# Altium schematic sheet 0_Overview.SchDoc: Overview
size A3; DocumentNumber: 1; SheetNumber: 1; SheetTotal: 6; PageSetup: Record=PageOptions|CenterHorizontal=True|CenterVertical=True|PrintScale=1.01|XCorrection=1.00|YCorrection=1.00|PrintKind=0|BorderSize=5000000|LeftOffset=0|BottomOffset=0|Orientation=2|PaperLength=1000|PaperWidth=1000|Scale=100|PaperSource=7|PrintQuality=-4|MediaType=1|DitherType=10|PaperKind=A3|PrintScaleMode=1
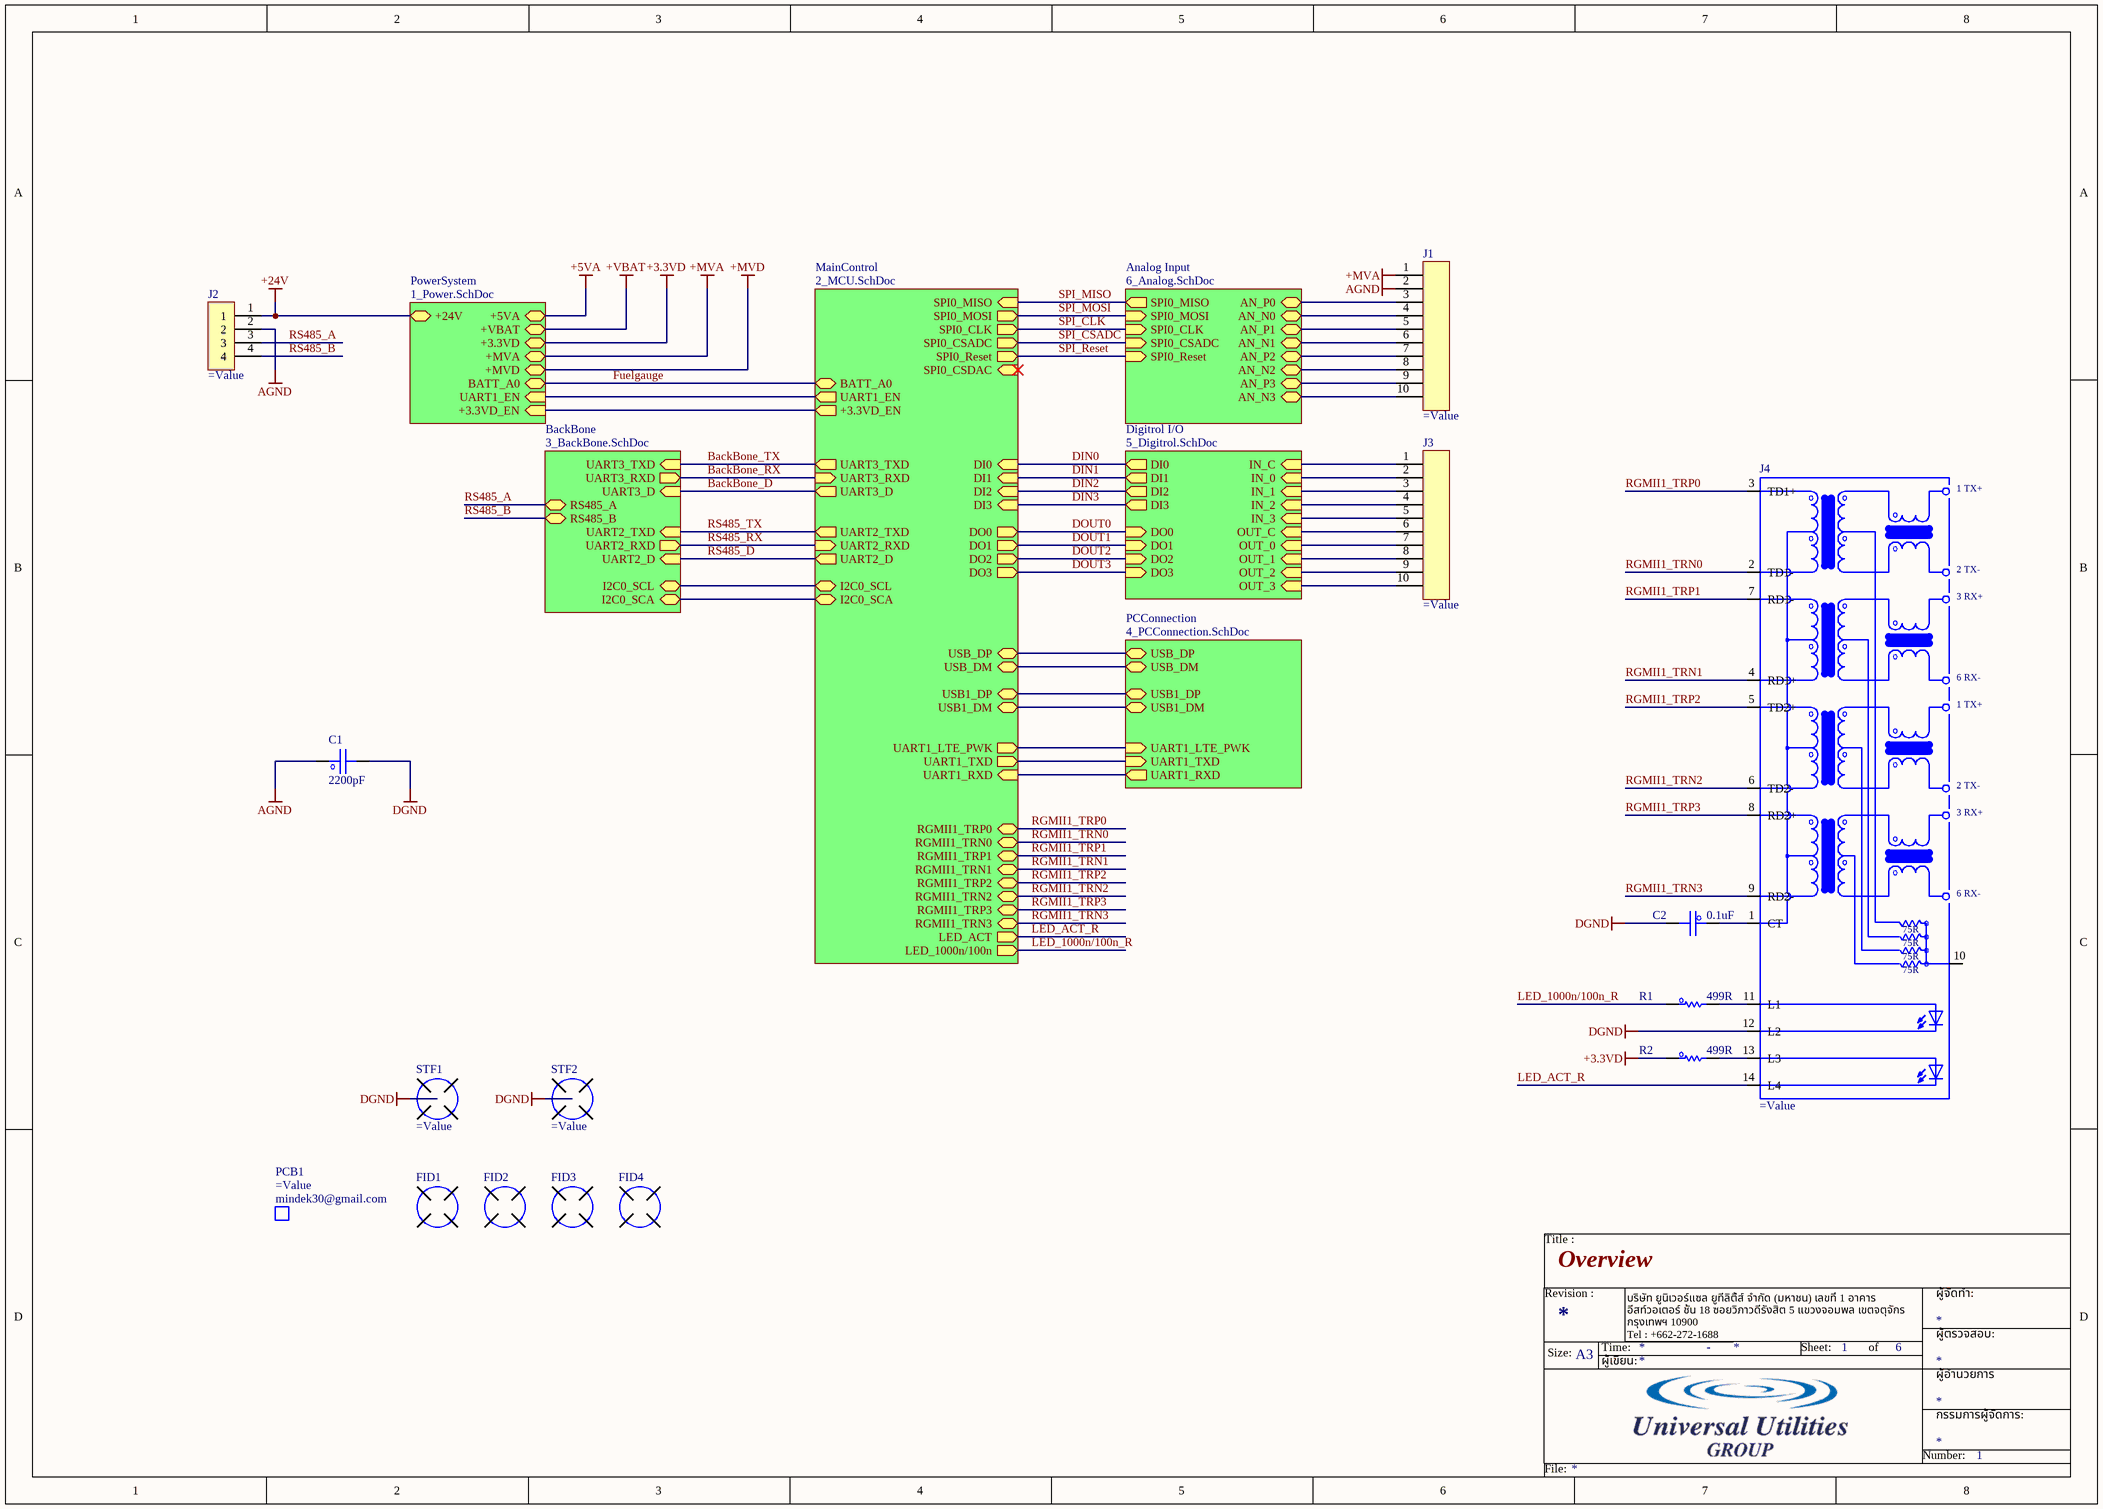
[diagram p0: 0_Overview.SchDoc]

## Parts
C1  2200pF  [C_1206]
C2  0.1uF  [C_0603]
FID1  FIDUCIAL  [FID]  (value not drawn)  (no BOM)
FID2  FIDUCIAL  [FID]  (value not drawn)  (no BOM)
FID3  FIDUCIAL  [FID]  (value not drawn)  (no BOM)
FID4  FIDUCIAL  [FID]  (value not drawn)  (no BOM)
J1  (no value)  [CON_10P_Terminal]
J2  (no value)  [CON_4P_Terminal]
J3  (no value)  [CON_10P_Terminal]
J4  (no value)  [HY911103A_HAN]
PCB1  Manufacturer: mindek30@gmail.com  (mechanical)
R1  499R  [R_0603]
R2  499R  [R_0603]
STF1  (no value)  [StandOff]
STF2  (no value)  [StandOff]

## Sub-sheets
Analog Input = 6_Analog.SchDoc: SPI0_MISO (out), SPI0_MOSI (in), SPI0_CLK (in), SPI0_CSADC (in), SPI0_Reset (in), AN_P0 (bidir), AN_P1 (bidir), AN_P2 (bidir), AN_P3 (bidir), AN_N0 (bidir), AN_N1 (bidir), AN_N2 (bidir), AN_N3 (bidir)
BackBone = 3_BackBone.SchDoc: UART2_D (in), UART3_TXD (in), UART3_RXD (out), UART3_D (in), UART2_TXD (in), UART2_RXD (out), RS485_A (bidir), RS485_B (bidir), I2C0_SCL (bidir), I2C0_SCA (bidir)
Digitrol I/O = 5_Digitrol.SchDoc: DI0 (out), DI1 (out), DI2 (out), DI3 (out), DO0 (in), DO1 (in), DO2 (in), DO3 (in), IN_0 (in), IN_1 (in), IN_2 (in), IN_3 (in), OUT_0 (in), OUT_1 (in), OUT_2 (in), OUT_3 (in), OUT_C (in), IN_C (in)
MainControl = 2_MCU.SchDoc: SPI0_MISO (in), SPI0_MOSI (out), SPI0_CLK (out), DI0 (in), DI1 (in), DI2 (in), DI3 (in), DO0 (out), DO1 (out), DO2 (out), DO3 (out), SPI0_Reset (out), UART3_TXD (out), UART3_RXD (in), UART3_D (out), BATT_A0 (bidir), SPI0_CSADC (out), UART2_TXD (out), UART2_RXD (in), UART2_D (out), USB_DP (bidir), USB_DM (bidir), UART1_RXD (in), UART1_EN (out), UART1_TXD (out), I2C0_SCL (bidir), I2C0_SCA (bidir), USB1_DP (bidir), USB1_DM (bidir), RGMII1_TRN0 (bidir), RGMII1_TRP3 (bidir), RGMII1_TRP0 (bidir), RGMII1_TRP2 (bidir), RGMII1_TRP1 (bidir), RGMII1_TRN2 (bidir), RGMII1_TRN3 (bidir), RGMII1_TRN1 (bidir), LED_ACT (out), LED_1000n/100n (out), SPI0_CSDAC (in), +3.3VD_EN (out), UART1_LTE_PWK (out)
PCConnection = 4_PCConnection.SchDoc: UART1_TXD (in), UART1_RXD (out), USB1_DP (bidir), USB1_DM (bidir), USB_DM (bidir), USB_DP (bidir), UART1_LTE_PWK (in)
PowerSystem = 1_Power.SchDoc: +5VA (bidir), +24V (bidir), +3.3VD (bidir), +MVA (bidir), +MVD (bidir), BATT_A0 (bidir), +VBAT (bidir), UART1_EN (in), +3.3VD_EN (in)

## Nets
+3.3VD: R2.1 ; sheet PowerSystem/+3.3VD
+5VA: sheet PowerSystem/+5VA
+24V: J2.1 ; sheet PowerSystem/+24V
+MVA: J1.1 ; sheet PowerSystem/+MVA
+MVD: sheet PowerSystem/+MVD
+VBAT: sheet PowerSystem/+VBAT
AGND: C1.1 J1.2 J2.2
DGND: C1.2 C2.2 J4.12(L2) STF1.1 STF2.1
BackBone_D: sheet MainControl/UART3_D, sheet BackBone/UART3_D
BackBone_RX: sheet MainControl/UART3_RXD, sheet BackBone/UART3_RXD
BackBone_TX: sheet MainControl/UART3_TXD, sheet BackBone/UART3_TXD
DIN0: sheet MainControl/DI0, sheet Digitrol I/O/DI0
DIN1: sheet MainControl/DI1, sheet Digitrol I/O/DI1
DIN2: sheet MainControl/DI2, sheet Digitrol I/O/DI2
DIN3: sheet MainControl/DI3, sheet Digitrol I/O/DI3
DOUT0: sheet MainControl/DO0, sheet Digitrol I/O/DO0
DOUT1: sheet MainControl/DO1, sheet Digitrol I/O/DO1
DOUT2: sheet MainControl/DO2, sheet Digitrol I/O/DO2
DOUT3: sheet MainControl/DO3, sheet Digitrol I/O/DO3
Fuelgauge: sheet MainControl/BATT_A0, sheet PowerSystem/BATT_A0
LED_1000n/100n_R: R1.1 ; sheet MainControl/LED_1000n/100n
LED_ACT_R: J4.14(L4) ; sheet MainControl/LED_ACT
RGMII1_TRN0: J4.2(TD1-) ; sheet MainControl/RGMII1_TRN0
RGMII1_TRN1: J4.4(RD1+) ; sheet MainControl/RGMII1_TRN1
RGMII1_TRN2: J4.6(TD2-) ; sheet MainControl/RGMII1_TRN2
RGMII1_TRN3: J4.9(RD2-) ; sheet MainControl/RGMII1_TRN3
RGMII1_TRP0: J4.3(TD1+) ; sheet MainControl/RGMII1_TRP0
RGMII1_TRP1: J4.7(RD1-) ; sheet MainControl/RGMII1_TRP1
RGMII1_TRP2: J4.5(TD2+) ; sheet MainControl/RGMII1_TRP2
RGMII1_TRP3: J4.8(RD2+) ; sheet MainControl/RGMII1_TRP3
RS485_A: J2.3 ; sheet BackBone/RS485_A
RS485_B: J2.4 ; sheet BackBone/RS485_B
RS485_D: sheet MainControl/UART2_D, sheet BackBone/UART2_D
RS485_RX: sheet MainControl/UART2_RXD, sheet BackBone/UART2_RXD
RS485_TX: sheet MainControl/UART2_TXD, sheet BackBone/UART2_TXD
SPI_CLK: sheet MainControl/SPI0_CLK, sheet Analog Input/SPI0_CLK
SPI_CSADC: sheet MainControl/SPI0_CSADC, sheet Analog Input/SPI0_CSADC
SPI_MISO: sheet MainControl/SPI0_MISO, sheet Analog Input/SPI0_MISO
SPI_MOSI: sheet MainControl/SPI0_MOSI, sheet Analog Input/SPI0_MOSI
SPI_Reset: sheet MainControl/SPI0_Reset, sheet Analog Input/SPI0_Reset
NetC2_1: C2.1 J4.1(CT)
NetJ1_3: J1.3 ; sheet Analog Input/AN_P0
NetJ1_4: J1.4 ; sheet Analog Input/AN_N0
NetJ1_5: J1.5 ; sheet Analog Input/AN_P1
NetJ1_6: J1.6 ; sheet Analog Input/AN_N1
NetJ1_7: J1.7 ; sheet Analog Input/AN_P2
NetJ1_8: J1.8 ; sheet Analog Input/AN_N2
NetJ1_9: J1.9 ; sheet Analog Input/AN_P3
NetJ1_10: J1.10 ; sheet Analog Input/AN_N3
NetJ3_1: J3.1 ; sheet Digitrol I/O/IN_C
NetJ3_2: J3.2 ; sheet Digitrol I/O/IN_0
NetJ3_3: J3.3 ; sheet Digitrol I/O/IN_1
NetJ3_4: J3.4 ; sheet Digitrol I/O/IN_2
NetJ3_5: J3.5 ; sheet Digitrol I/O/IN_3
NetJ3_6: J3.6 ; sheet Digitrol I/O/OUT_C
NetJ3_7: J3.7 ; sheet Digitrol I/O/OUT_0
NetJ3_8: J3.8 ; sheet Digitrol I/O/OUT_1
NetJ3_9: J3.9 ; sheet Digitrol I/O/OUT_2
NetJ3_10: J3.10 ; sheet Digitrol I/O/OUT_3
NetJ4_11: J4.11(L1) R1.2
NetJ4_13: J4.13(L3) R2.2
(unnamed): sheet MainControl/USB_DP, sheet PCConnection/USB_DP
(unnamed): sheet MainControl/USB_DM, sheet PCConnection/USB_DM
(unnamed): sheet MainControl/UART1_RXD, sheet PCConnection/UART1_RXD
(unnamed): sheet MainControl/UART1_EN, sheet PowerSystem/UART1_EN
(unnamed): sheet MainControl/UART1_TXD, sheet PCConnection/UART1_TXD
(unnamed): sheet MainControl/I2C0_SCL, sheet BackBone/I2C0_SCL
(unnamed): sheet MainControl/I2C0_SCA, sheet BackBone/I2C0_SCA
(unnamed): sheet MainControl/USB1_DP, sheet PCConnection/USB1_DP
(unnamed): sheet MainControl/USB1_DM, sheet PCConnection/USB1_DM
(unnamed): sheet MainControl/+3.3VD_EN, sheet PowerSystem/+3.3VD_EN
(unnamed): sheet MainControl/UART1_LTE_PWK, sheet PCConnection/UART1_LTE_PWK

Not connected (* = marked no-connect by the designer): J4 10(CT)

## Notes on the sheet
- Title :
- Revision :
- ผู้จัดทำ:
- Size:
- A3
- Time:
- ผู้เขียน:
- บริษัท ยูนิเวอร์แซล ยูทีลิตี้ส์ จำกัด (มหาชน) เลขที่ 1 อาคาร อีสท์วอเตอร์ ชั้น 18 ซอยวิภาวดีรังสิต 5 แขวงจอมพล เขตจตุจักร กรุงเทพฯ 10900
  Tel : +662-272-1688
  Fax :+662-2721690-1
- -
- Sheet:
- of
- ผู้อำนวยการ
- ผู้ตรวจสอบ:
- Number:
- กรรมการผู้จัดการ:
- File:
- (in symbol CON_RJ45_1) 1 TX+; 2 TX-; 3 RX+; 6 RX-; 75R

## Library data of the parts
C1 = C_Capacitor: CAP CER 2200PF 1KV X7R 1206; Manufacturer: AVX Corporation; PartNumber: 1206AC222KAT1A; PackageReference: 1206; PartID: 478-2953-1-ND; Value2: 1kV; Value: 2200pF; Value3: *
C2 = C_Capacitor: CAP CER 0.1UF 50V X7R 0603; Manufacturer: KEMET; PartNumber: C0603C104K5RACTU; PackageReference: 0603; PartID: 399-5089-1-ND; Value2: 50V; Value: 0.1uF; Value3: *
FID1-FID4 = FID_FIDUCIAL: Manufacturer: mindek30@gmail.com; Value2: Non SE; Value: Non SE; PartNumber: =PCB_PN+'_'+PCB_Rev; PartID: =PCB_Rev; PackageReference: Non SE; Value3: Non SE
J1 J3 = CON_10P_Terminal: TERM BLOCK HDR 10POS 90DEG 3.5MM; PartNumber: 1843871; Manufacturer: Phoenix Contact; Value: 1843871; Value3: 1966172; PartID: 277-6521-ND; PackageReference: *; Value2: *
J2 = CON_4P_Terminal: TERM BLOCK HDR 4POS 90DEG 3.5MM; PartNumber: 1843813; Manufacturer: Phoenix Contact; Value: 1843813; PartID: 277-6088-ND; PackageReference: *; Value2: *; Value3: *
J4 = CON_RJ45_1: RJ45 RJReceptacle 1 Internal oscillator included Internal oscillator included Plugin Ethernet Connectors/Modular Connectors (RJ45 RJ11) ROHS; PartNumber: HY911103A; Manufacturer: HANRUN(Zhongshan HanRun Elec); Value: HY911103A; PartID: C55679; PackageReference: *; Value2: *; Value3: *
PCB1 = PCB_Bare: BARE PCB; PartNumber: =PCB_PN+'_'+PCB_Rev; PackageReference: Non SE; PartID: =PCB_Rev; Value2: =JobFile_Title; Value: =PartNumber; Value3: =PCBA_PN+'_'+PCBA_Rev
R1 R2 = R_Resister: RES 499 OHM 1% 1/10W 0603; Manufacturer: Vishay Dale; PartNumber: CRCW0603499RFKEAC; Value2: 0.1W; Value: 499R; PackageReference: 0603; PartID: 541-3986-1-ND; Value3: *
STF1 STF2 = FID_STANDOFF: ROUND STANDOFF M2X0.4 STEEL 2MM; Manufacturer: Würth Elektronik; PartNumber: 9774020243R; Value: 9774020243R; PartID: 732-7073-1-ND; PackageReference: *; Value2: *; Value3: *